# EAGLE design StairLights_clips (EAGLE 9.6.2)
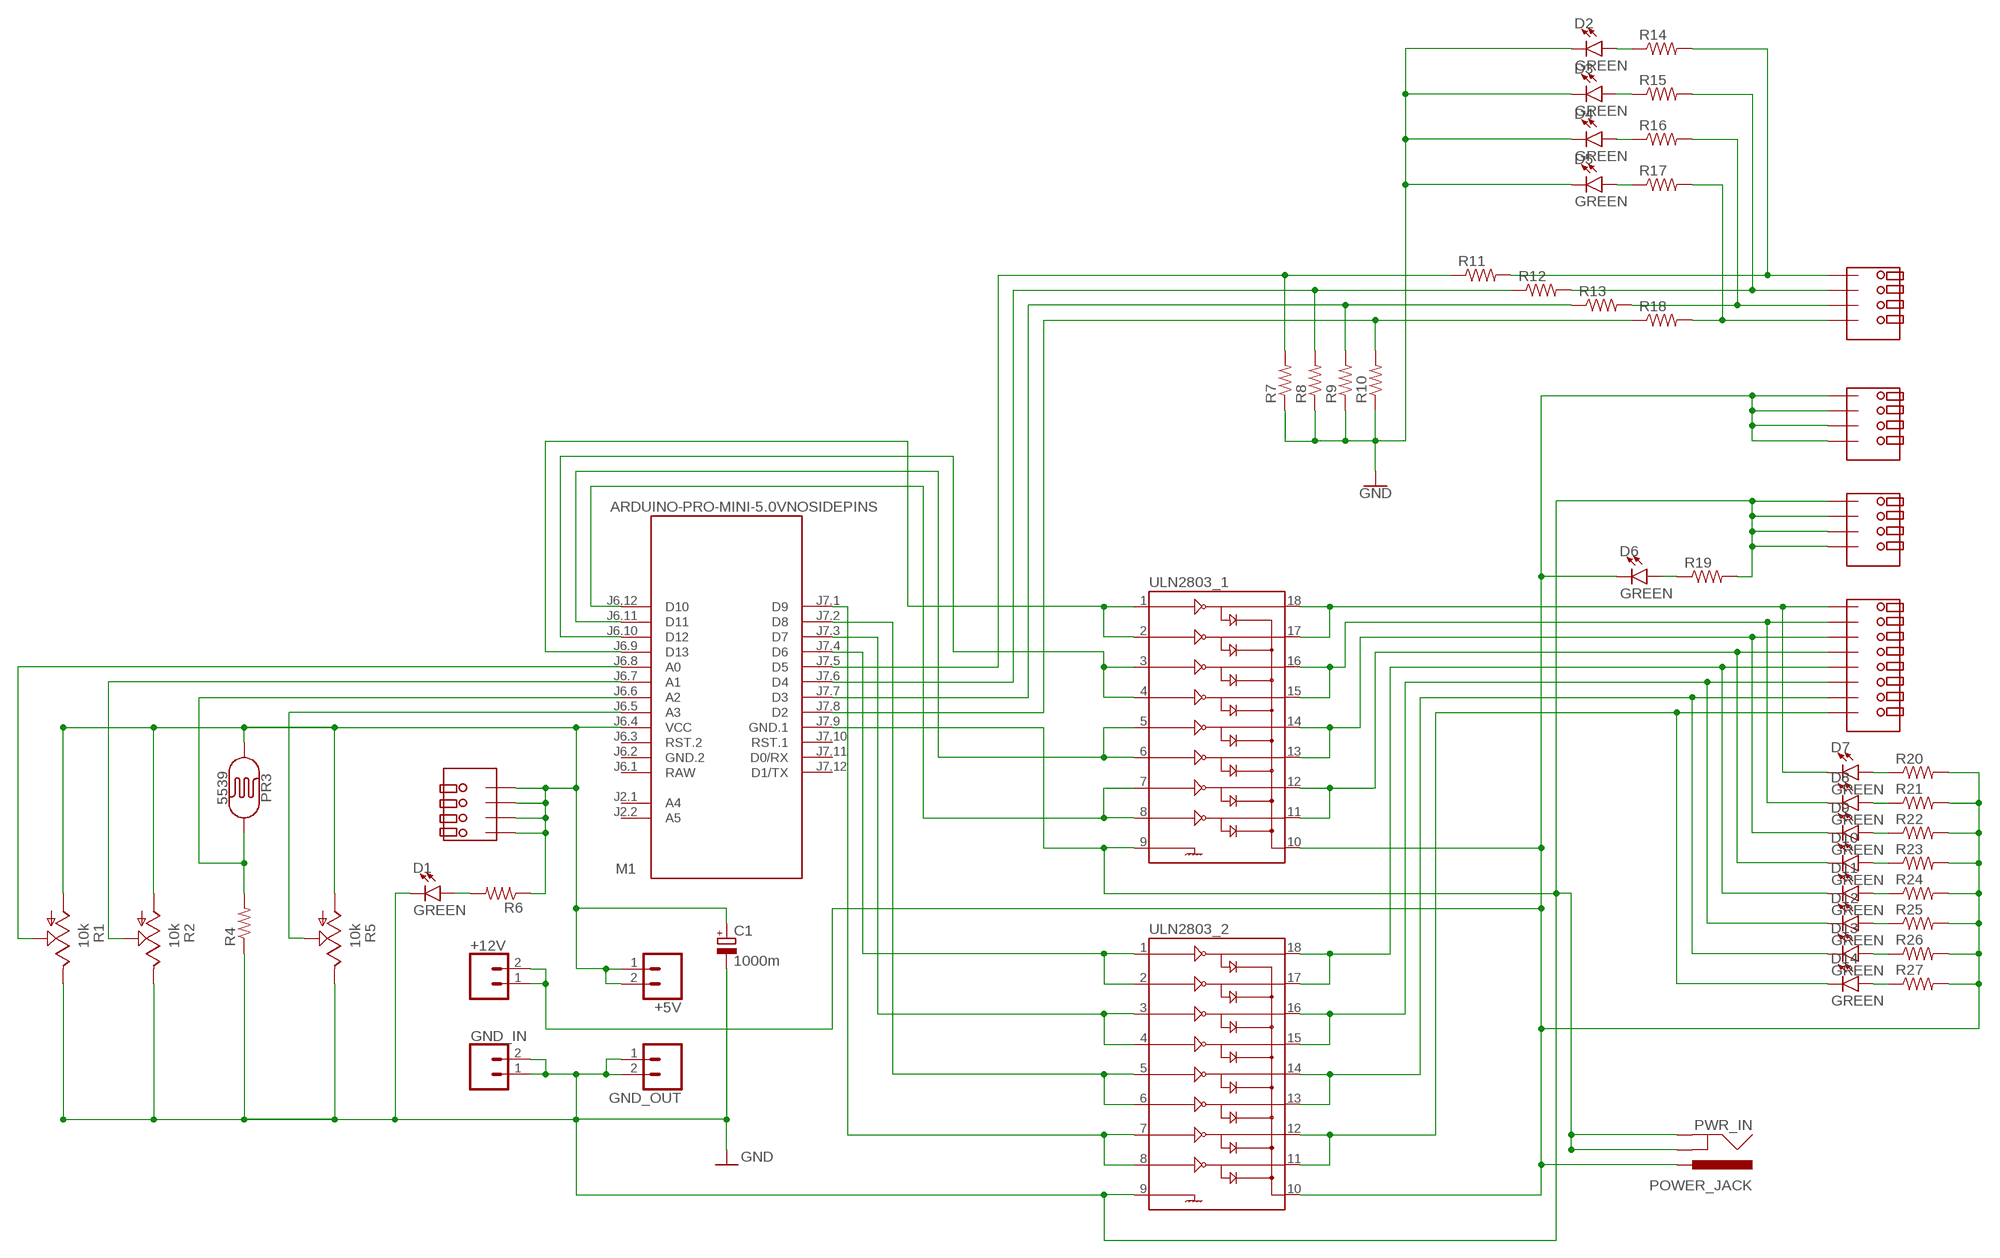
[diagram p0: schematic, sheet 1]

## Parts
+5V  CONN_02  [1X02]
+12V  CONN_02  [1X02]
C1  1000m  CPOL-EUE5-5  [E5-5]
D1  GREEN  LED-GREEN1206  [LED-1206]
D2  GREEN  LED-GREEN1206  [LED-1206]
D3  GREEN  LED-GREEN1206  [LED-1206]
D4  GREEN  LED-GREEN1206  [LED-1206]
D5  GREEN  LED-GREEN1206  [LED-1206]
D6  GREEN  LED-GREEN1206  [LED-1206]
D7  GREEN  LED-GREEN1206  [LED-1206]
D8  GREEN  LED-GREEN1206  [LED-1206]
D9  GREEN  LED-GREEN1206  [LED-1206]
D10  GREEN  LED-GREEN1206  [LED-1206]
D11  GREEN  LED-GREEN1206  [LED-1206]
D12  GREEN  LED-GREEN1206  [LED-1206]
D13  GREEN  LED-GREEN1206  [LED-1206]
D14  GREEN  LED-GREEN1206  [LED-1206]
GND_IN  CONN_02  [1X02]
GND_OUT  CONN_02  [1X02]
M1  ARDUINO-PRO-MINI-5.0VNOSIDEPINS  [ARDUINO-PRO-MINI]
PR3  5539  PHOTOCELLPTH  [PHOTOCELL]
PWR_IN  POWER_JACK  [POWER_JACK_PTH]
R1  10k  TRIM_US-S64W  [S64W]
R2  10k  TRIM_US-S64W  [S64W]
R4  10k  R-US_R0805  [R0805]
R5  10k  TRIM_US-S64W  [S64W]
R6  330  R-US_R0805  [R0805]
R7  10k  R-US_R0805  [R0805]
R8  10k  R-US_R0805  [R0805]
R9  10k  R-US_R0805  [R0805]
R10  10k  R-US_R0805  [R0805]
R11  330  R-US_R0805  [R0805]
R12  330  R-US_R0805  [R0805]
R13  330  R-US_R0805  [R0805]
R14  330  R-US_R0805  [R0805]
R15  330  R-US_R0805  [R0805]
R16  330  R-US_R0805  [R0805]
R17  330  R-US_R0805  [R0805]
R18  330  R-US_R0805  [R0805]
R19  330  R-US_R0805  [R0805]
R20  330  R-US_R0805  [R0805]
R21  330  R-US_R0805  [R0805]
R22  330  R-US_R0805  [R0805]
R23  330  R-US_R0805  [R0805]
R24  330  R-US_R0805  [R0805]
R25  330  R-US_R0805  [R0805]
R26  330  R-US_R0805  [R0805]
R27  330  R-US_R0805  [R0805]
SC1  KF141V-4  [KF141V-4]
SC2  KF141V-4  [KF141V-4]
SC3  KF141V-4  [KF141V-4]
SC4  KF141V-4  [KF141V-4]
SC5  KF141V-8  [KF141V-8]
ULN2803_1  ULN2803DIP  [DIL18]
ULN2803_2  ULN2803DIP  [DIL18]

## Nets
GND: C1.- D1.C D2.C D3.C D4.C D5.C GND_IN.1 GND_IN.2 GND_OUT.1 GND_OUT.2 M1.J7.9(GND.1) PWR_IN.GND PWR_IN.GNDBREAK R1.E R2.E R4.1 R5.E R7.1 R8.1 R9.1 R10.1 R19.2 SC4.P$1 SC4.P$2 SC4.P$3 SC4.P$4 SC4.P$9 SC4.P$10 SC4.P$11 SC4.P$12 ULN2803_1.9 ULN2803_2.9
N$1: D7.C SC5.P$1 SC5.P$9 ULN2803_1.17 ULN2803_1.18
N$2: D8.C SC5.P$2 SC5.P$10 ULN2803_1.15 ULN2803_1.16
N$3: M1.J7.7(D3) R9.2 R13.1
N$4: D9.C SC5.P$3 SC5.P$11 ULN2803_1.13 ULN2803_1.14
N$5: M1.J6.12(D10) ULN2803_1.7 ULN2803_1.8
N$6: D10.C SC5.P$4 SC5.P$12 ULN2803_1.11 ULN2803_1.12
N$7: M1.J6.6(A2) PR3.2 R4.2
N$8: D11.C SC5.P$5 SC5.P$13 ULN2803_2.17 ULN2803_2.18
N$9: D12.C SC5.P$6 SC5.P$14 ULN2803_2.15 ULN2803_2.16
N$10: M1.J6.11(D11) ULN2803_1.5 ULN2803_1.6
N$11: D13.C SC5.P$7 SC5.P$15 ULN2803_2.13 ULN2803_2.14
N$12: M1.J7.8(D2) R10.2 R18.1
N$13: M1.J7.3(D7) ULN2803_2.3 ULN2803_2.4
N$14: R13.2 R16.2 SC2.P$3 SC2.P$11
N$15: M1.J6.5(A3) R5.S
N$16: D1.A R6.2
N$17: +5V.1 +5V.2 C1.+ M1.J6.4(VCC) PR3.1 R1.A R2.A R5.A R6.1 SC1.P$1 SC1.P$2 SC1.P$3 SC1.P$4 SC1.P$9 SC1.P$10 SC1.P$11 SC1.P$12
N$18: D14.C SC5.P$8 SC5.P$16 ULN2803_2.11 ULN2803_2.12
N$19: R17.2 R18.2 SC2.P$4 SC2.P$12
N$20: M1.J7.6(D4) R8.2 R12.1
N$21: M1.J7.1(D9) ULN2803_2.7 ULN2803_2.8
N$22: M1.J7.5(D5) R7.2 R11.1
N$23: R12.2 R15.2 SC2.P$2 SC2.P$10
N$24: M1.J6.9(D13) ULN2803_1.1 ULN2803_1.2
N$25: R11.2 R14.2 SC2.P$1 SC2.P$9
N$26: M1.J6.10(D12) ULN2803_1.3 ULN2803_1.4
N$27: M1.J6.7(A1) R2.S
N$28: M1.J6.8(A0) R1.S
N$29: M1.J7.4(D6) ULN2803_2.1 ULN2803_2.2
N$30: M1.J7.2(D8) ULN2803_2.5 ULN2803_2.6
N$31: D7.A R20.1
N$32: D8.A R21.1
N$33: D9.A R22.1
N$34: D10.A R23.1
N$35: D11.A R24.1
N$36: D12.A R25.1
N$37: D13.A R26.1
N$38: D14.A R27.1
N$39: +12V.1 +12V.2 D6.C PWR_IN.PWR R20.2 R21.2 R22.2 R23.2 R24.2 R25.2 R26.2 R27.2 SC3.P$1 SC3.P$2 SC3.P$3 SC3.P$4 SC3.P$9 SC3.P$10 SC3.P$11 SC3.P$12 ULN2803_1.10 ULN2803_2.10
N$40: D6.A R19.1
N$41: D2.A R14.1
N$42: D3.A R15.1
N$43: D4.A R16.1
N$44: D5.A R17.1
Unconnected: M1.J2.1(A4) M1.J2.2(A5) M1.J6.3(RST.2) M1.J7.10(RST.1) M1.J7.11(D0/RX) M1.J7.12(D1/TX)

## Power pins joined to a net without a drawn wire
GND.2: M1.J6.2(GND.2)
RAW: M1.J6.1(RAW)

## Library data of the parts
+5V +12V GND_IN GND_OUT = SparkFun-Connectors:CONN_02: Multi connection point. Often used as Generic Header-pin footprint for 0.1 inch spaced/style header connections On any of the 0.1 inch spaced packages, you can populate with these: Break Away Headers - Straight <https://www.sparkfun.com/products/116> (PRT-00116) Break Away Male Headers - Right Angle <https://www.sparkfun.com/products/553> (PRT-00553) Female Headers <https://www.sparkfun.com/products/115> (PRT-00115) Break Away Headers - Machine Pin <https://www.sparkfun.com/products/117> (PRT-00117) Break Away Female Headers - Swiss Machine Pin <https://www.sparkfun.com/products/743> (PRT-00743) For SCREWTERMINALS and SPRING TERMINALS visit here: Screw Terimnals on SparkFun.com <https://www.sparkfun.com/search/results?term=Screw+Terminals> (5mm/3.5mm/2.54mm spacing) This device is also useful as a general connection point to wire up your design to another part of your project. Our various solder wires solder well into these plated through hole pads. Hook-Up Wire - Assortment (Stranded, 22 AWG) <https://www.sparkfun.com/products/11375> (PRT-11375) Hook-Up Wire - Assortment (Solid Core, 22 AWG) <https://www.sparkfun.com/products/11367> (PRT-11367) View the entire wire category on our website here <https://www.sparkfun.com/categories/141> Special notes: Molex polarized connector foot print use with: PRT-08233 with associated crimp pins and housings. 2.54_SCREWTERM for use with PRT-10571. 3.5mm Screw Terminal footprints for PRT-08084 5mm Screw Terminal footprints for use with PRT-08432
C1 = resistor:CPOL-EU: POLARIZED CAPACITOR, European symbol
D1-D14 = SparkFun-LED:LED-GREEN: Green SMD LED Used in manufacturing of various products at SparkFun Packages: 0603 - SMD 0603 package [Product Link] <http://www.futureelectronics.com/en/technologies/semiconductors/optoelectronics/leds/Pages/9894312-LTST-C190GKT.aspx?CrossPart=HSMG-C190&IM=0> LilyPad 1206 - SMD1206 LilyPad package [Product Link] <http://www.futureelectronics.com/en/Technologies/Product.aspx?ProductID=IN150NGHARVATEKCORPORATION2049943&IM=0> 1206 - SMD1206 package [Product Link] <http://www.futureelectronics.com/en/technologies/semiconductors/optoelectronics/leds/Pages/8315665-LTST-C150KGKT.aspx?IM=0> 1206 Bottom Mount -SMD 1206 Bottom Mount [Product Link] <http://www.digikey.com/product-detail/en/lite-on-inc/LTST-C230KGKT/160-1456-1-ND/386854> SparkFun Products: Pro Mini 328 -5V <https://www.sparkfun.com/products/821> RedBoard <https://www.sparkfun.com/products/12757> MP3 Trigger <https://www.sparkfun.com/products/13720> Makey Makey <https://www.sparkfun.com/products/11076>; PROD_ID: DIO-00862
M1 = diy-modules:ARDUINO-PRO-MINI-*: Arduino Pro Mini and compatible devices More details available here: https://www.arduino.cc/en/Main/ArduinoBoardProMini Click here to find device on ebay.com <http://www.ebay.com/sch/arduino+pro+mini>
PR3 = SparkFun-Sensors:PHOTOCELL: Photocell (Photodetector, Photo Resistor, CdS) This is a very small light sensor. A photocell changes (also called a photodetector, photo resistor, CdS or photoconductive cell) resistance depending on the amount of light it is exposed to. These little sensors make great ambient light triggers (when light in the room turns on, do something). Datasheet <http://cdn.sparkfun.com/datasheets/Sensors/LightImaging/SEN-09088.pdf> SparkFun Products Mini Photocell <https://www.sparkfun.com/products/9088> (SEN-09088); PROD_ID: COMP-09129; SF_ID: SEN-09088
PWR_IN = SparkFun-Connectors:POWER_JACK: Power Jack Connector This is the standard 5.5mm barrel jack for power. The PTH is the most common, proven, reliable, footprint. The Slot footprint only works if the mill layer is transmitted to the PCB fab house so be warned. Here are the connectors we sell at SparkFun: DC Barrel Power Jack/Connector <https://www.sparkfun.com/products/119> (PRT-00119) DC Barrel Power Jack/Connector (SMD) <https://www.sparkfun.com/products/12748> (PRT-12748) DC Barrel Jack Adapter - Breadboard Compatible <https://www.sparkfun.com/products/10811> (PRT-10811) It is used on this SparkFun product (and many, many others): SparkFun RedBoard - Programmed with Arduino <https://www.sparkfun.com/products/12757> (DEV-12757) Also, if you need a mating power supply or connector, please check these out: Wall Adapter Power Supply - 9VDC 650mA <https://www.sparkfun.com/products/298> (TOL-00298) DC Barrel Jack Adapter - Male <https://www.sparkfun.com/products/10287> (PRT-10287); PROD_ID: CONN-08197
R1 R2 R5 = pot:TRIM_US-: POTENTIOMETER
R4 R6-R27 = resistor:R-US_: RESISTOR, American symbol
SC1-SC4 = mylibrary:KF141V-4: kf141v-4 spring connector
SC5 = mylibrary:KF141V-8: kf141v-8 spring connector
ULN2803_1 ULN2803_2 = SparkFun-IC-Special-Function:ULN2803: Darlington Driver(IC-07959, low stock) ULN2803 Darlington array. 500mA max per channel, 8-channel package. Spark Fun Electronics SKU : COM-00312

## Board
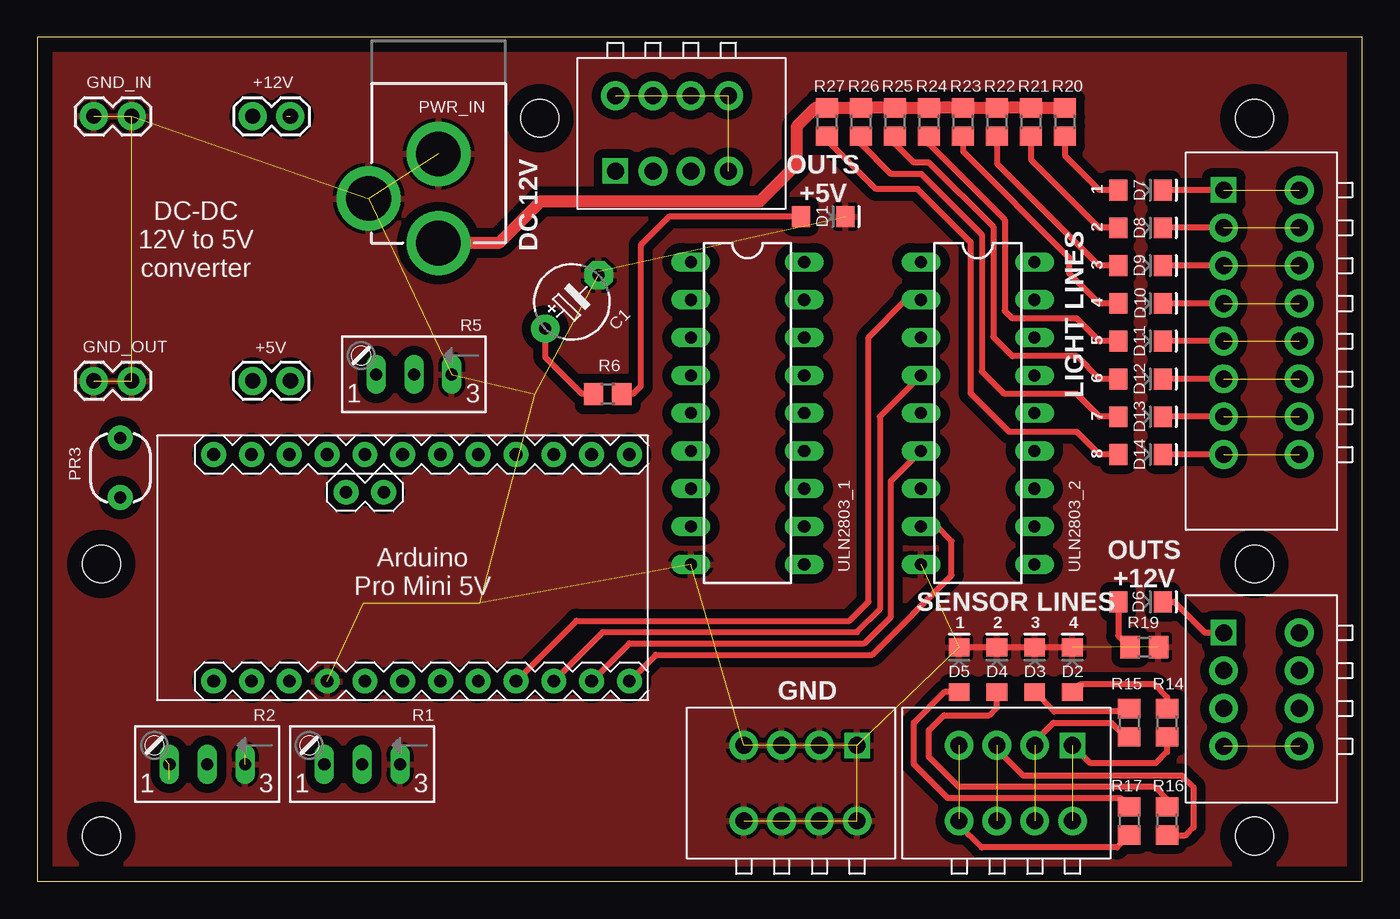
[diagram p1: board, top side]
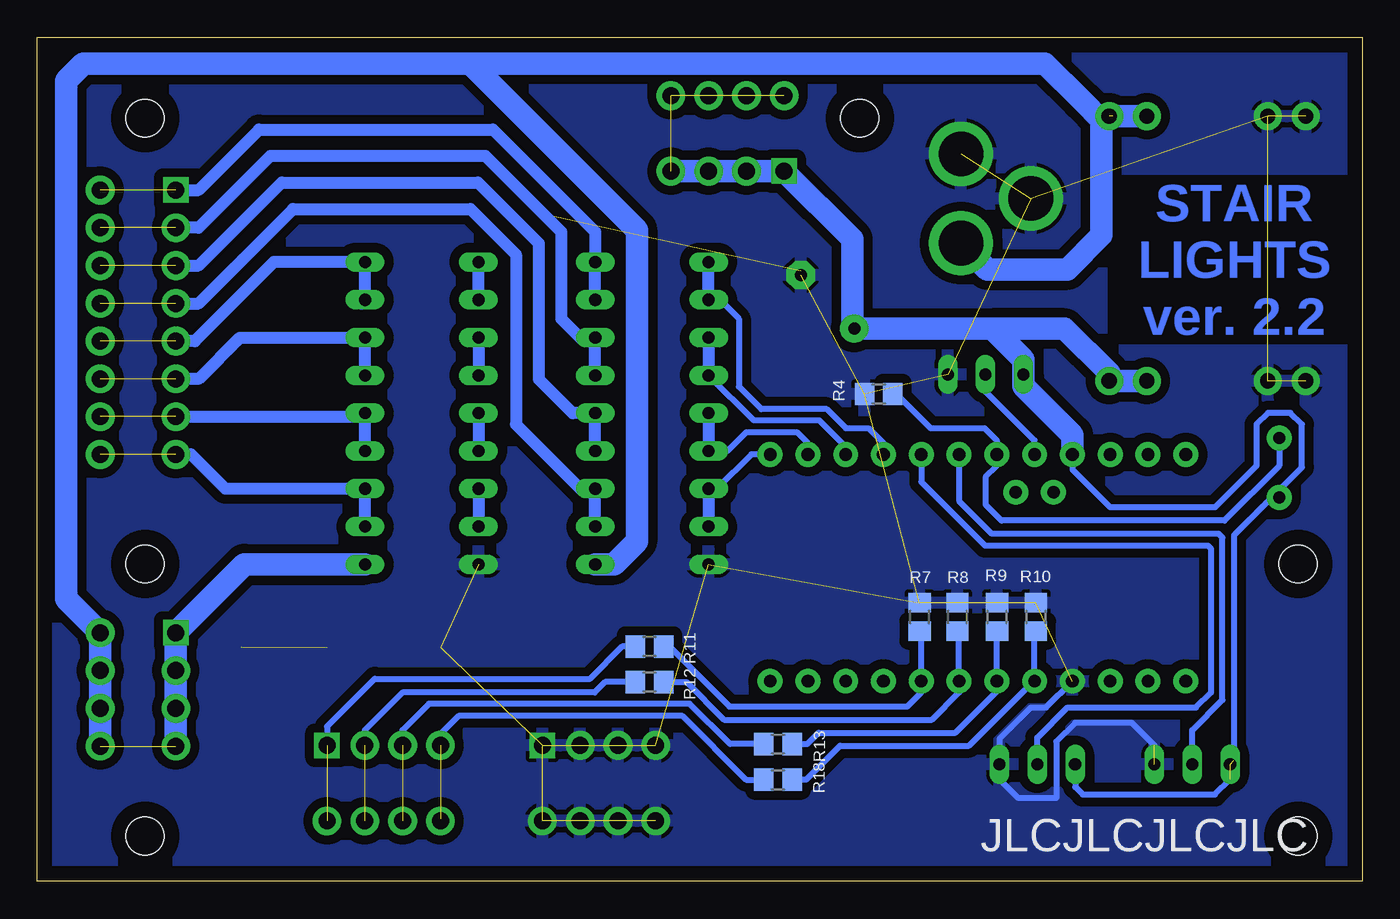
[diagram p2: board, bottom side, seen from below]

Size 89.08 x 56.76 mm. Coordinates in mm from the lower left corner, seen from the top.
Outline: 0,0 89.08,0 89.08,56.76 0,56.76 0,0
Copper layers (1*16): Top 0.035mm / dielectric 1.5mm / Bottom 0.035mm
Design rules "default": minimum track width 6mil, minimum drill 0.35mm, track to track 6mil, track to pad 6mil, pad to pad 6mil, via to via 6mil, smd to smd 6mil, copper to edge 40mil, drill to drill 6mil, minimum pad ring 10mil, minimum via ring 8mil, stop-mask expansion 4mil, vias tented up to drill 0mil, thermal gap 10mil
Holes 2.54 mm at 4.32,3.05 33.78,51.31 81.83,3.05 81.83,21.34 4.32,21.34 81.83,51.31

### Footprints (pad centres in the part's own frame; a part is rotated, then mirrored left to right if it is on the bottom)
1X02 = drill 1.016 pad 1.88: 1 0,0; 2 2.54,0
E5-5 = drill 0.813 pad 1.905: + -2.54,0 | drill 0.813 pad 1.905 octagon: - 2.54,0
LED-1206 = smd 1.2 x 1.4: A -1.5,0; C 1.5,0
ARDUINO-PRO-MINI = drill 0.85 pad 1.676: J2.1 -1.27,5.08; J2.2 -3.81,5.08; J6.1 -12.7,7.62; J6.2 -10.16,7.62; J6.3 -7.62,7.62; J6.4 -5.08,7.62; J6.5 -2.54,7.62; J6.6 0,7.62; J6.7 2.54,7.62; J6.8 5.08,7.62; J6.9 7.62,7.62; J6.10 10.16,7.62; J6.11 12.7,7.62; J6.12 15.24,7.62; J7.1 15.24,-7.62; J7.2 12.7,-7.62; J7.3 10.16,-7.62; J7.4 7.62,-7.62; J7.5 5.08,-7.62; J7.6 2.54,-7.62; J7.7 0,-7.62; J7.8 -2.54,-7.62; J7.9 -5.08,-7.62; J7.10 -7.62,-7.62; J7.11 -10.16,-7.62; J7.12 -12.7,-7.62
PHOTOCELL = drill 0.8 pad 1.676: 1 -2,0; 2 2,0
POWER_JACK_PTH = drill 2.997 pad 4.318: GND 0,7.7; GNDBREAK 4.7,10.7; PWR 0,13.7
S64W = drill 0.813 long: A 2.54,1.27; E -2.54,1.27; S 0,1.27
R0805 = smd 1.3 x 1.5: 1 -0.95,0; 2 0.95,0
KF141V-4 = drill 1.143 pad 1.676 square: P$1 0,0 | drill 1.143 pad 1.93: P$2 0,-2.54; P$3 0,-5.08; P$4 0,-7.62; P$9 5.08,0; P$10 5.08,-2.54; P$11 5.08,-5.08; P$12 5.08,-7.62
KF141V-8 = drill 1.143 pad 1.676 square: P$1 0,0 | drill 1.143 pad 1.93: P$2 0,-2.54; P$3 0,-5.08; P$4 0,-7.62; P$5 0,-10.16; P$6 0,-12.7; P$7 0,-15.24; P$8 0,-17.78; P$9 5.08,0; P$10 5.08,-2.54; P$11 5.08,-5.08; P$12 5.08,-7.62; P$13 5.08,-10.16; P$14 5.08,-12.7; P$15 5.08,-15.24; P$16 5.08,-17.78
DIL18 = drill 0.813 long: 1 -10.16,-3.81; 2 -7.62,-3.81; 3 -5.08,-3.81; 4 -2.54,-3.81; 5 0,-3.81; 6 2.54,-3.81; 7 5.08,-3.81; 8 7.62,-3.81; 9 10.16,-3.81; 10 10.16,3.81; 11 7.62,3.81; 12 5.08,3.81; 13 2.54,3.81; 14 0,3.81; 15 -2.54,3.81; 16 -5.08,3.81; 17 -7.62,3.81; 18 -10.16,3.81

### Placement (x,y rotation side)
+5V  17.02,33.66 180 top
+12V  14.48,51.43 0 top
C1  35.95,38.96 45 top
D1  52.83,44.7 0 top
D2  69.6,14.22 90 top
D3  67.06,14.22 90 top
D4  64.52,14.22 90 top
D5  61.98,14.22 90 top
D6  74.17,18.8 0 top
D7  74.17,46.48 0 top
D8  74.17,43.94 0 top
D9  74.17,41.4 0 top
D10  74.17,38.86 0 top
D11  74.17,36.32 0 top
D12  74.17,33.78 0 top
D13  74.17,31.24 0 top
D14  74.17,28.7 0 top
GND_IN  3.81,51.43 0 top
GND_OUT  3.81,33.66 0 top
M1  24.57,21.08 0 top
PR3  5.59,27.81 90 top
PWR_IN  26.98,56.62 180 top
R1  21.84,9.14 180 top
R2  11.43,9.14 180 top
R4  32.51,32.77 0 bottom
R5  25.33,35.35 180 top
R6  38.35,32.77 0 top
R7  29.76,17.78 270 bottom
R8  27.22,17.78 270 bottom
R9  24.56,17.78 270 bottom
R10  21.94,17.78 270 bottom
R11  47.91,15.79 180 bottom
R12  47.91,13.4 180 bottom
R13  39.28,9.23 180 bottom
R14  75.95,10.67 270 top
R15  73.41,10.67 270 top
R16  75.95,4.06 270 top
R17  73.41,4.06 270 top
R18  39.28,6.84 180 bottom
R19  74.42,15.75 0 top
R20  69.09,51.05 90 top
R21  66.8,51.05 90 top
R22  64.52,51.05 90 top
R23  62.23,51.05 90 top
R24  59.94,51.05 90 top
R25  57.66,51.05 90 top
R26  55.37,51.05 90 top
R27  53.09,51.05 90 top
SC1  38.86,47.75 90 top
SC2  69.6,9.14 270 top
SC3  79.76,16.71 0 top
SC4  55.12,9.14 270 top
SC5  79.76,46.48 0 top
ULN2803_1  47.75,31.48 270 top
ULN2803_2  63.23,31.48 270 top

### Tracks (layer width: path | path; a pad name or v marks a point on that pad's centre or on a via)
GND  (27 unrouted)
  Top 0.406: 37.74,41.04 C1.- | D2.C D3.C D4.C D5.C
  Bottom 0.406: 13.97,9.14 15.49,10.67 19.3,10.67 20.57,9.4 20.57,5.59 23.11,5.59 24.38,6.86 R1.E 24.38,9.58 22.28,11.68 21.27,11.68 M1.J7.9
  pour Bottom (isolate 0.61): -0.64,57.4 89.41,57.4 89.41,-0.25 -0.5,-0.25
  pour Top (isolate 0.61): -0.26,57.15 89.41,57.15 89.41,-0.25 0,-0.25
N$1  (1 unrouted)
  Top 0.406: SC5.P$1 D7.C
  Bottom 0.813: ULN2803_1.17 ULN2803_1.18 51.56,43.67 58.44,50.55 74.17,50.55 78.23,46.48 SC5.P$1
N$2  (1 unrouted)
  Top 0.406: SC5.P$2 D8.C
  Bottom 0.813: ULN2803_1.15 ULN2803_1.16 52.58,36.56 53.85,37.83 53.85,43.67 58.94,48.77 73.41,48.77 78.23,43.94 SC5.P$2
N$3
  Bottom 0.406: R13.1 37.31,9.23 36.55,9.99 27.35,9.99 24.57,12.77 M1.J7.7 R9.2
N$4  (1 unrouted)
  Top 0.406: SC5.P$3 D9.C
  Bottom 0.813: ULN2803_1.13 ULN2803_1.14 53.09,31.48 55.37,33.77 55.37,42.91 59.45,46.99 72.64,46.99 78.23,41.4 SC5.P$3
N$5
  Bottom 0.406: ULN2803_1.7 43.38,26.4 41.08,28.7 M1.J6.12
  Bottom 0.813: ULN2803_1.7 ULN2803_1.8
N$6  (1 unrouted)
  Top 0.406: SC5.P$4 D10.C
  Bottom 0.813: ULN2803_1.11 ULN2803_1.12 52.58,26.4 56.9,30.72 56.9,42.15 59.96,45.21 71.88,45.21 78.23,38.86 SC5.P$4
N$7
  Bottom 0.406: R4.2 31.31,32.77 29.02,30.48 25.4,30.48 24.57,29.65 M1.J6.6 24.57,27.94 25.33,27.18 25.33,25.33 24.26,24.26 9.27,24.26 5.59,27.94 PR3.2
N$8  (1 unrouted)
  Top 0.406: SC5.P$5 D11.C
  Bottom 0.508: 67.04,41.42 ULN2803_2.18 | ULN2803_2.17 67.28,38.86
  Bottom 0.813: 67.29,38.85 ULN2803_2.17 ULN2803_2.18 73.17,41.64 78.49,36.32 SC5.P$5
N$9  (1 unrouted)
  Top 0.406: SC5.P$6 D12.C
  Bottom 0.508: SC5.P$6 79.5,33.78
  Bottom 0.813: ULN2803_2.15 ULN2803_2.16 75.45,36.56 78.23,33.78 SC5.P$6
N$10
  Bottom 0.406: M1.J6.11 37.27,29.46 38.01,30.21 41.4,30.21 42.67,28.94 ULN2803_1.6
  Bottom 0.508: 43.43,31.48 ULN2803_1.5
  Bottom 0.813: ULN2803_1.5 ULN2803_1.6
N$11  (1 unrouted)
  Top 0.406: SC5.P$7 D13.C
  Bottom 0.813: ULN2803_2.13 ULN2803_2.14 67.28,31.24 SC5.P$7
N$12
  Bottom 0.406: R18.1 37.39,6.84 35.1,9.13 26.43,9.13 22.1,13.46 M1.J7.8 22.03,16.75 R10.2
N$13
  Top 0.406: M1.J7.3 38.03,16.76 55.12,16.76 56.64,18.29 56.64,31.24 ULN2803_2.4
  Bottom 0.813: ULN2803_2.3 ULN2803_2.4
N$14  (1 unrouted)
  Top 0.406: R16.2 77.22,3.11 77.72,3.62 77.72,6.35 76.96,7.11 66.29,7.11 64.52,8.89 SC2.P$3
  Bottom 0.406: R13.2 42.51,9.23 45.21,11.94 62.74,11.94 64.52,10.16 SC2.P$3
N$15
  Bottom 0.406: M1.J6.5 22.03,29.65 25.33,32.95 R5.S
N$16
  Top 0.406: D1.A 42.48,44.7 40.57,42.79 40.57,33.27 40.07,32.77 R6.2
N$17  (6 unrouted)
  Top 0.406: R6.1 36.64,32.77 34.15,35.26 C1.+
  Bottom 0.406: R1.A 19.3,6.35 18.8,5.84 9.91,5.84 8.89,6.86 | 8.64,8.13 8.64,23.27 6.1,25.81 PR3.1 5.59,26.31 4.06,27.84 4.06,30.73 4.83,31.5 6.35,31.5 7.11,30.73 7.11,27.94 9.91,25.15 16.95,25.15 19.49,27.69 M1.J6.4
  Bottom 1.524: +5V.2 +5V.1 17.02,34.16 20.02,37.17 24.86,37.17 | 24.86,37.17 C1.+ 34.29,37.31 34.29,43.18 SC1.P$1 SC1.P$2 SC1.P$3 SC1.P$4 | M1.J6.4 19.49,30.02 22.79,33.32 R5.A 22.79,35.1 24.86,37.17
N$18  (1 unrouted)
  Top 0.406: SC5.P$8 D14.C
  Bottom 0.813: ULN2803_2.11 ULN2803_2.12 76.44,26.4 78.74,28.7 SC5.P$8
N$19  (1 unrouted)
  Top 0.406: R17.2 72.58,2.29 63.5,2.29 61.98,3.81 SC2.P$12
  Bottom 0.406: SC2.P$12 61.98,4.22 | R18.2 41.42,6.84 45.71,11.12 60.76,11.12 61.98,9.91 SC2.P$4
N$20
  Bottom 0.406: R12.1 45.44,13.4 42.9,10.86 28.95,10.86 27.11,12.7 M1.J7.6 27.11,16.71 R8.2
N$21
  Top 0.406: M1.J7.1 41.59,15.24 56.13,15.24 61.47,20.57 61.47,22.86 60.47,23.86 ULN2803_2.8
  Bottom 0.813: ULN2803_2.7 ULN2803_2.8
N$22
  Bottom 0.406: R11.1 46.58,15.79 42.55,11.75 30.59,11.75 29.65,12.7 M1.J7.5 29.65,16.71 R7.2
N$23  (1 unrouted)
  Top 0.406: R15.2 73.15,9.72 72.2,10.67 68.33,10.67 67.06,9.4 SC2.P$2
  Bottom 0.406: R12.2 50.9,13.4 51.6,12.7 64.52,12.7 67.06,10.16 SC2.P$2
N$24
  Bottom 0.406: ULN2803_1.2 43.18,39.1 41.91,37.83 41.91,33.26 40.4,31.75 36,31.75 34.73,30.48 33.2,30.48 32.19,29.46 M1.J6.9
  Bottom 0.813: ULN2803_1.2 ULN2803_1.1
N$25  (1 unrouted)
  Top 0.406: R14.2 75.95,8.7 75.18,7.94 70.8,7.94 SC2.P$1
  Bottom 0.406: 69.51,9.23 SC2.P$1 69.6,10.41 66.38,13.63 51.91,13.63 49.75,15.79 R11.2
N$26
  Bottom 0.406: 34.73,29.21 36.51,30.99 40.91,30.99 ULN2803_1.4
  Bottom 0.508: 34.73,29.21 M1.J6.10
  Bottom 0.813: ULN2803_1.3 ULN2803_1.4
N$27
  Bottom 0.406: R2.S 11.43,10.16 9.4,12.19 9.4,23.11 9.65,23.37 24.89,23.37 27.11,25.58 M1.J6.7
N$28
  Bottom 0.406: R1.S 21.84,9.65 19.81,11.68 11.18,11.68 10.16,12.7 10.16,22.35 10.36,22.55 25.35,22.55 29.65,26.85 M1.J6.8
N$29
  Top 0.406: M1.J7.4 36.25,17.53 54.61,17.53 55.88,18.8 55.88,36.58 58.4,39.1 ULN2803_2.2
  Bottom 0.813: ULN2803_2.2 ULN2803_2.1
N$30
  Top 0.406: M1.J7.2 39.81,16 55.63,16 57.39,17.76 57.39,26.91 ULN2803_2.6
  Bottom 0.813: ULN2803_2.5 ULN2803_2.6
N$31
  Top 0.406: D7.A 71.4,46.48 69.09,48.79 R20.1
N$32
  Top 0.406: R21.1 66.8,48.51 71.37,43.94 D8.A
N$33
  Top 0.406: R22.1 64.52,48.26 71.37,41.4 D9.A
N$34
  Top 0.406: R23.1 62.23,49.09 69.37,41.95 69.37,40.89 71.4,38.86 D10.A
N$35
  Top 0.406: D11.A 71.4,36.32 69.87,37.85 65.56,37.85 65.05,38.35 65.05,44.49 59.94,49.6 R24.1
N$36
  Top 0.406: R25.1 57.66,49.6 58.93,48.33 59.94,48.33 64.26,44.01 64.26,36.6 65.56,35.31 69.87,35.31 71.4,33.78 D12.A
N$37
  Top 0.406: R26.1 55.37,49.6 57.4,47.56 59.44,47.56 63.5,43.5 63.5,34.29 65.02,32.77 69.87,32.77 71.4,31.24 D13.A
N$38
  Top 0.406: R27.1 53.09,49.85 56.39,46.55 59.18,46.55 62.74,42.99 62.74,32.83 65.34,30.23 69.87,30.23 71.4,28.7 D14.A
N$39  (2 unrouted)
  Top 0.406: D6.C 76.43,18.8 78.51,16.71 SC3.P$1
  Top 0.813: PWR_IN.PWR 31.04,42.91 33.84,45.71 48.57,45.71 51.05,48.2 51.05,50.73 52.32,52 R27.2 R26.2 R25.2 R24.2 R23.2 R22.2 R21.2 R20.2
  Bottom 0.508: +12V.2 17.78,51.44
  Bottom 1.27: 17.78,51.44 18.86,52.52
  Bottom 1.524: 59.94,54.98 21.32,54.98 18.86,52.52 17.53,51.18 17.53,43.43 19.81,41.15 25.21,41.15 PWR_IN.PWR | 59.94,54.98 85.99,54.98 87.12,53.85 87.12,19 SC3.P$9 SC3.P$10 SC3.P$11 SC3.P$12 | 16.76,51.44 +12V.1 | ULN2803_1.10 50.31,21.32 48.77,22.86 48.77,43.8 59.94,54.98 | SC3.P$4 SC3.P$3 SC3.P$2 SC3.P$1 75.15,21.32 ULN2803_2.10
N$40
  Top 0.406: D6.A 72.67,16.51 73.43,15.75 R19.1
N$41
  Top 0.406: R14.1 75.95,12.38 75.09,13.23 70.1,13.23 D2.A
N$42
  Top 0.406: R15.1 73.22,11.43 68.35,11.43 D3.A
N$43
  Top 0.406: R16.1 75.95,5.52 75.12,6.35 61.98,6.35 59.94,8.38 59.94,10.16 60.96,11.18 64.01,11.18 64.52,11.68 D4.A
N$44
  Top 0.406: R17.1 72.83,5.59 61.21,5.59 58.93,7.87 58.93,10.67 60.98,12.72 D5.A

### Text on the board
Bottom: STAIR / LIGHTS / ver. 2.2
tNames: OUTS / +5V | DC 12V | 1 | 2 | DC-DC / 12V to 5V / converter | 3 | 4 | 5 | 6 | LIGHT LINES | 7 | 8 | OUTS / +12V | Arduino / Pro Mini 5V | SENSOR LINES | 1 | 2 | 3 | 4 | GND
bNames: JLCJLCJLCJLC